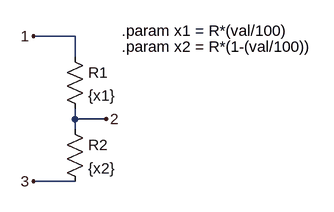
[diagram p0: schematic pot.asc]
pot.asc, the LTspice schematic file:
Version 4
SHEET 1 880 680
WIRE 176 64 112 64
WIRE 176 96 176 64
WIRE 176 192 176 176
WIRE 224 192 176 192
WIRE 176 208 176 192
WIRE 176 288 112 288
FLAG 112 64 1
FLAG 224 192 2
FLAG 112 288 3
SYMBOL res 160 80 R0
SYMATTR InstName R1
SYMATTR Value {x1}
SYMBOL res 160 192 R0
SYMATTR InstName R2
SYMATTR Value {x2}
TEXT 248 56 Left 2 !.param x1 = R*(val/100)
TEXT 248 80 Left 2 !.param x2 = R*(1-(val/100))

The netlist it stands for:
* pot.asc
R1 1 2 {x1}
R2 2 3 {x2}
.param x1 = R*(val/100)
.param x2 = R*(1-(val/100))
.backanno
.end